# Altium schematic sheet STM32F103.SchDoc
size A3
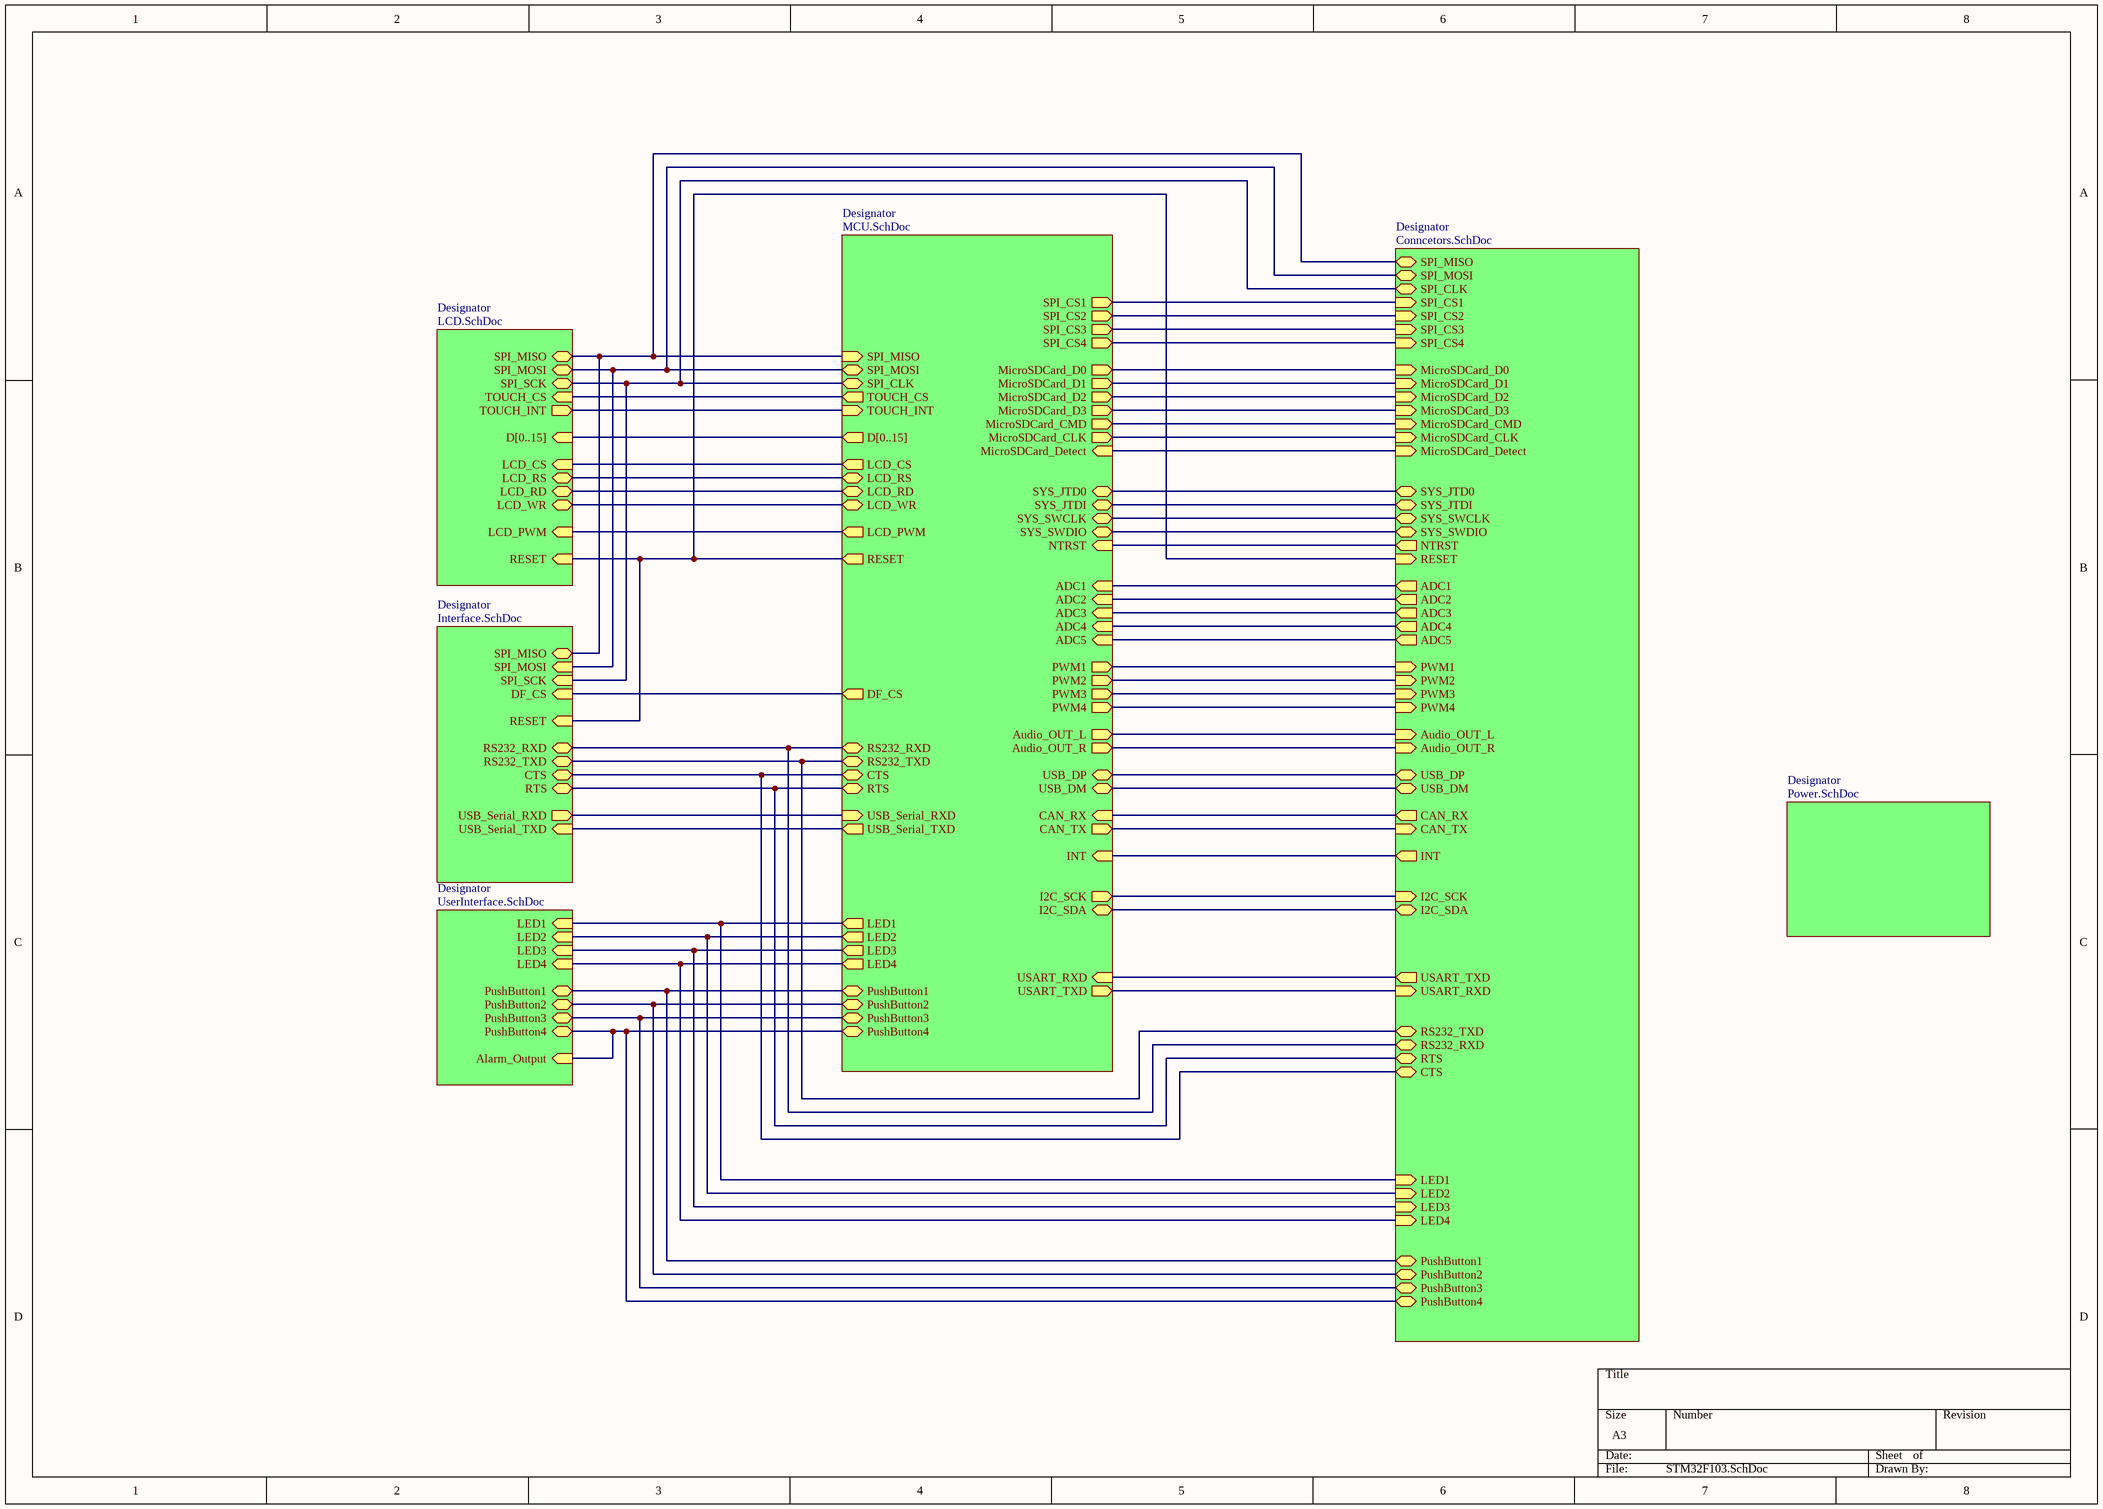
[diagram p0: STM32F103.SchDoc]

## Sub-sheets
Designator = MCU.SchDoc: D[0..15] (out), SPI_MISO (in), SPI_MOSI (bidir), SPI_CLK (bidir), TOUCH_CS (out), TOUCH_INT (in), LCD_CS (out), LCD_RS (bidir), LCD_RD (bidir), LCD_WR (bidir), LCD_PWM (out), RESET (out), DF_CS (out), RS232_RXD (bidir), RS232_TXD (bidir), CTS (bidir), RTS (bidir), USB_Serial_RXD (in), USB_Serial_TXD (out), LED1 (out), LED2 (out), LED3 (out), LED4 (out), PushButton1 (bidir), PushButton2 (bidir), PushButton3 (bidir), PushButton4 (bidir), I2C_SCK (out), I2C_SDA (bidir), USART_TXD (out), USART_RXD (in), INT (in), CAN_TX (out), CAN_RX (in), USB_DM (bidir), USB_DP (bidir), Audio_OUT_L (out), Audio_OUT_R (out), PWM1 (out), PWM2 (out), PWM3 (out), PWM4 (out), ADC1 (in), ADC2 (in), ADC3 (in), ADC4 (in), ADC5 (in), NTRST (in), SYS_SWDIO (bidir), SYS_SWCLK (bidir), SYS_JTDI (bidir), SYS_JTD0 (bidir), MicroSDCard_D0 (out), MicroSDCard_D1 (out), MicroSDCard_D2 (out), MicroSDCard_D3 (out), MicroSDCard_CMD (out), MicroSDCard_CLK (out), MicroSDCard_Detect (in), SPI_CS1 (out), SPI_CS2 (out), SPI_CS3 (out), SPI_CS4 (out)
Designator = Power.SchDoc: no entries
Designator = Conncetors.SchDoc: MicroSDCard_D0 (in), MicroSDCard_D1 (in), MicroSDCard_D2 (in), MicroSDCard_D3 (in), MicroSDCard_CMD (in), MicroSDCard_CLK (in), MicroSDCard_Detect (in), SYS_JTD0 (bidir), SYS_JTDI (bidir), SYS_SWCLK (bidir), SYS_SWDIO (bidir), NTRST (out), RESET (in), LED1 (in), LED2 (in), LED3 (in), LED4 (in), PushButton1 (bidir), PushButton2 (bidir), PushButton3 (bidir), PushButton4 (bidir), ADC1 (out), ADC2 (out), ADC3 (out), ADC4 (out), ADC5 (out), PWM1 (in), PWM2 (in), PWM3 (in), PWM4 (in), Audio_OUT_L (in), Audio_OUT_R (in), USB_DP (bidir), USB_DM (bidir), CAN_RX (out), CAN_TX (in), SPI_MISO (bidir), SPI_MOSI (bidir), SPI_CLK (bidir), SPI_CS1 (in), SPI_CS2 (in), SPI_CS3 (in), INT (out), USART_TXD (out), USART_RXD (in), RS232_RXD (bidir), RS232_TXD (bidir), RTS (bidir), CTS (bidir), SPI_CS4 (in), I2C_SDA (bidir), I2C_SCK (in)
Designator = Interface.SchDoc: SPI_MISO, SPI_MOSI (in), SPI_SCK (in), DF_CS (in), RESET (in), RS232_RXD (bidir), RS232_TXD (bidir), CTS (bidir), RTS (bidir), USB_Serial_RXD (out), USB_Serial_TXD (in)
Designator = UserInterface.SchDoc: LED1 (in), LED2 (in), LED3 (in), LED4 (in), PushButton1 (bidir), PushButton2 (bidir), PushButton3 (bidir), PushButton4 (bidir), Alarm_Output (in)
Designator = LCD.SchDoc: D[0..15] (in), LCD_CS (in), LCD_RS (bidir), LCD_RD (bidir), LCD_WR (bidir), RESET (in), LCD_PWM (in), SPI_MISO (bidir), SPI_MOSI (bidir), SPI_SCK (bidir), TOUCH_CS (in), TOUCH_INT (out)

## Nets
(unnamed): sheet Designator/SPI_MISO, sheet Designator/SPI_MISO, sheet Designator/SPI_MISO, sheet Designator/SPI_MISO
(unnamed): sheet Designator/SPI_MOSI, sheet Designator/SPI_MOSI, sheet Designator/SPI_MOSI, sheet Designator/SPI_MOSI
(unnamed): sheet Designator/SPI_CLK, sheet Designator/SPI_CLK, sheet Designator/SPI_SCK, sheet Designator/SPI_SCK
(unnamed): sheet Designator/TOUCH_CS, sheet Designator/TOUCH_CS
(unnamed): sheet Designator/TOUCH_INT, sheet Designator/TOUCH_INT
(unnamed): sheet Designator/LCD_CS, sheet Designator/LCD_CS
(unnamed): sheet Designator/LCD_RS, sheet Designator/LCD_RS
(unnamed): sheet Designator/LCD_RD, sheet Designator/LCD_RD
(unnamed): sheet Designator/LCD_WR, sheet Designator/LCD_WR
(unnamed): sheet Designator/LCD_PWM, sheet Designator/LCD_PWM
(unnamed): sheet Designator/RESET, sheet Designator/RESET, sheet Designator/RESET, sheet Designator/RESET
(unnamed): sheet Designator/DF_CS, sheet Designator/DF_CS
(unnamed): sheet Designator/RS232_RXD, sheet Designator/RS232_RXD, sheet Designator/RS232_RXD
(unnamed): sheet Designator/RS232_TXD, sheet Designator/RS232_TXD, sheet Designator/RS232_TXD
(unnamed): sheet Designator/CTS, sheet Designator/CTS, sheet Designator/CTS
(unnamed): sheet Designator/RTS, sheet Designator/RTS, sheet Designator/RTS
(unnamed): sheet Designator/USB_Serial_RXD, sheet Designator/USB_Serial_RXD
(unnamed): sheet Designator/USB_Serial_TXD, sheet Designator/USB_Serial_TXD
(unnamed): sheet Designator/LED1, sheet Designator/LED1, sheet Designator/LED1
(unnamed): sheet Designator/LED2, sheet Designator/LED2, sheet Designator/LED2
(unnamed): sheet Designator/LED3, sheet Designator/LED3, sheet Designator/LED3
(unnamed): sheet Designator/LED4, sheet Designator/LED4, sheet Designator/LED4
(unnamed): sheet Designator/PushButton1, sheet Designator/PushButton1, sheet Designator/PushButton1
(unnamed): sheet Designator/PushButton2, sheet Designator/PushButton2, sheet Designator/PushButton2
(unnamed): sheet Designator/PushButton3, sheet Designator/PushButton3, sheet Designator/PushButton3
(unnamed): sheet Designator/PushButton4, sheet Designator/PushButton4, sheet Designator/PushButton4, sheet Designator/Alarm_Output
(unnamed): sheet Designator/I2C_SCK, sheet Designator/I2C_SCK
(unnamed): sheet Designator/I2C_SDA, sheet Designator/I2C_SDA
(unnamed): sheet Designator/USART_TXD, sheet Designator/USART_RXD
(unnamed): sheet Designator/USART_RXD, sheet Designator/USART_TXD
(unnamed): sheet Designator/INT, sheet Designator/INT
(unnamed): sheet Designator/CAN_TX, sheet Designator/CAN_TX
(unnamed): sheet Designator/CAN_RX, sheet Designator/CAN_RX
(unnamed): sheet Designator/USB_DM, sheet Designator/USB_DM
(unnamed): sheet Designator/USB_DP, sheet Designator/USB_DP
(unnamed): sheet Designator/Audio_OUT_L, sheet Designator/Audio_OUT_L
(unnamed): sheet Designator/Audio_OUT_R, sheet Designator/Audio_OUT_R
(unnamed): sheet Designator/PWM1, sheet Designator/PWM1
(unnamed): sheet Designator/PWM2, sheet Designator/PWM2
(unnamed): sheet Designator/PWM3, sheet Designator/PWM3
(unnamed): sheet Designator/PWM4, sheet Designator/PWM4
(unnamed): sheet Designator/ADC1, sheet Designator/ADC1
(unnamed): sheet Designator/ADC2, sheet Designator/ADC2
(unnamed): sheet Designator/ADC3, sheet Designator/ADC3
(unnamed): sheet Designator/ADC4, sheet Designator/ADC4
(unnamed): sheet Designator/ADC5, sheet Designator/ADC5
(unnamed): sheet Designator/NTRST, sheet Designator/NTRST
(unnamed): sheet Designator/SYS_SWDIO, sheet Designator/SYS_SWDIO
(unnamed): sheet Designator/SYS_SWCLK, sheet Designator/SYS_SWCLK
(unnamed): sheet Designator/SYS_JTDI, sheet Designator/SYS_JTDI
(unnamed): sheet Designator/SYS_JTD0, sheet Designator/SYS_JTD0
(unnamed): sheet Designator/MicroSDCard_D0, sheet Designator/MicroSDCard_D0
(unnamed): sheet Designator/MicroSDCard_D1, sheet Designator/MicroSDCard_D1
(unnamed): sheet Designator/MicroSDCard_D2, sheet Designator/MicroSDCard_D2
(unnamed): sheet Designator/MicroSDCard_D3, sheet Designator/MicroSDCard_D3
(unnamed): sheet Designator/MicroSDCard_CMD, sheet Designator/MicroSDCard_CMD
(unnamed): sheet Designator/MicroSDCard_CLK, sheet Designator/MicroSDCard_CLK
(unnamed): sheet Designator/MicroSDCard_Detect, sheet Designator/MicroSDCard_Detect
(unnamed): sheet Designator/SPI_CS1, sheet Designator/SPI_CS1
(unnamed): sheet Designator/SPI_CS2, sheet Designator/SPI_CS2
(unnamed): sheet Designator/SPI_CS3, sheet Designator/SPI_CS3
(unnamed): sheet Designator/SPI_CS4, sheet Designator/SPI_CS4